# Altium project BNC_RJ45_adapter.PrjPcb
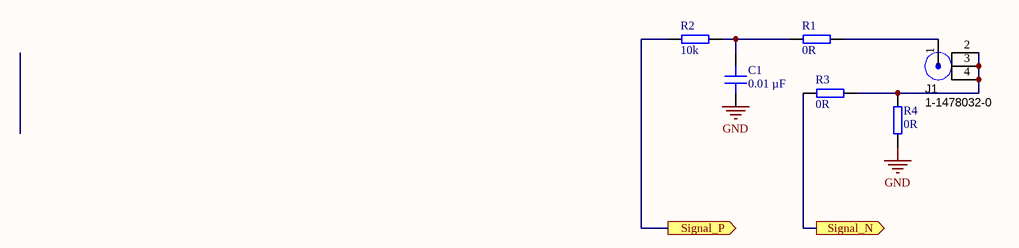
[diagram p0: schematic_rj45bnc.SchDoc]
ProjectRevision: 1.0
2 sheets, 12 parts. Net scope: hierarchical (ports join the sheet entries above them; power ports are global).
Board file: BNC_RJ45_8x.PcbDoc
Sheets:
  schematic_rj45bnc.SchDoc
  Top_sheet.SchDoc

## Sheet schematic_rj45bnc.SchDoc
size A4; Author: Florian Rosner; CompanyName: Technische Hochschule Nürnberg Georg Simon Ohm; Address1: Fürther Straße 250; Address2: 90429 Nürnberg; Address3: GERMANY; SheetNumber: 2; SheetTotal: 2; CompanyName2: Institut ELSYS

### Parts
(Parts that share a designator on the sheet are numbered #1, #2 ... from top to bottom, then left to right.)
C1  0.01 µF  [C_0805]
J1  1-1478032-0  [Right Angle BNC]
R1  0R  [RES 0805_2012]
R2  10k  [RES 1206_3216]
R3#1  0R  [RES 0805_2012]
R4#1  0R  [RES 0805_2012]

### Ports
Signal_N (out), Signal_P (out)

### Nets
GND: C1.1 R4#1.1  [project net AIN A N1]
NetC1_2: C1.2 R1.1 R2.2
NetJ1_1: J1.1 R1.2
NetJ1_2: J1.2 J1.3 J1.4 R3#1.2 R4#1.2
NetR2_1: R2.1 ; port Signal_P
NetR3#1_1: R3#1.1 ; port Signal_N

### Notes on the sheet
- Title
- Size:
- Date:
- A4
- Revision:
- Time:
- Sheet
- of
- Author:
- Project:

### Library data of the parts
C1 = C0805C103K3RACTU: Capacitor 0805, 25 VDC, 0.01 µF, X7R; Manufacturer: KEMET; Tolerance: 10 %; Voltage Rating: 25 VDC; Created from: MGremer; Manufacturer Part Number: C0805C103K3RACTU; PartID: 20; Created On: 20.12.2020 13:54:13; ComponentLink1Description: Datasheet; ComponentLink1URL: https://www.mouser.de/datasheet/2/212/KEM_C1002_X7R_SMD-1102033.pdf; Component Type: Capacitor 0805; Device Package: 0805; Last Updated: 17.11.2021 11:24:29; Mounting Type: SMD; Operating Temperature: -55 - 125°C; Series: SMD Comm X7R; Supplier 1: Mouser; Supplier Part Number 1: 80-C0805C103K3R; Type: Capacitor; Value: 0.01 µF; Live Cycle Status: 1; Stock number: Labor SMD Container
J1 = 1-1478032-0: BNC Connector; Manufacturer: TE; PartNumber: Used in BOM report; SymbolVersion: use current date i.e. 2008-05-20; SymbolCreator: Use LDAP id; CompType: Used in some BOM reports.  Useful for finding later.; U/M: EA, IN, or GM; Created from: FSchoenig, MGremer; MountType: SMT, TH, or N/A; RoHS: Used in BOM report.  Use Y or N.; PackageReference: eg:  0603, used in PnP report; ComponentLink1Description: Datasheet; ComponentLink1URL: https://www.te.com/commerce/DocumentDelivery/DDEController?Action=showdoc&DocId=Data+Sheet%7F6-1773448-5_ZDC_RF_COAX_50-75_OHM%7F1007%7Fpdf%7FEnglish%7FENG_DS_6-1773448-5_ZDC_RF_COAX_50-75_OHM_1007.pdf&src-supplier=Avnet; Alternate PartNumber: -; Alternate Manufacturer: -; Supplier 1: Digi-Key; Supplier Part Number 1: A97560-ND; Manufacturer Part Number: 1-1478032-0; PartID: 3; Created On: 12.05.2021 17:41:04; Component Type: BNC; Device Package: BNC; Last Updated: 24.08.2021 10:46:04; Mounting Type: THT; Type: BNC; Live Cycle Status: 1; Stock number: not stored
R1 R3#1 R4#1 = RC0805JR-100RL: SMD resistor 5%; Manufacturer: Yageo; Created from: MGremer; Manufacturer Part Number: RC0805JR-100RL; PartID: 186; Created On: 14.12.2020 16:17:14; ComponentLink1Description: Datasheet; ComponentLink1URL: https://www.mouser.com/catalog/specsheets/Yageo-03-18-2021-PYu-RC_Group_51_RoHS_L_11.pdf; Component Type: SMD resistor; Device Package: 0805; Last Updated: 14.12.2020 18:22:52; Mounting Type: SMD; Supplier 1: Mouser; Supplier Part Number 1: 603-RC0805JR-100RL; Type: Resistor; Tolerance: 5%; Value: 0R; Live Cycle Status: 1; Stock number: not stored
R2 = ERJ-8ENF1002V: SMD resistor 1%; Manufacturer: Panasonic; Created from: MGremer; Manufacturer Part Number: ERJ-8ENF1002V; PartID: 201; Created On: 14.12.2020 16:17:14; ComponentLink1Description: Datasheet; ComponentLink1URL: https://www.mouser.de/datasheet/2/315/AOA0000C304-1149620.pdf; Component Type: SMD resistor; Device Package: 1206; Last Updated: 24.01.2021 12:18:37; Mounting Type: SMD; Supplier 1: Mouser; Supplier Part Number 1: 667-ERJ-8ENF1002V; Type: Resistor; Tolerance: 1 %; Value: 10k; Live Cycle Status: 1; Stock number: not stored

## Sheet Top_sheet.SchDoc
size A4; CompanyName: Technische Hochschule Nürnberg Georg Simon Ohm; Organization: UltraZohm; Address1: Kesslerplatz 12; Address2: 90489 Nürnberg; Address3: GERMANY; SheetNumber: 1; SheetTotal: 2; Website: www.ultrazohm.com
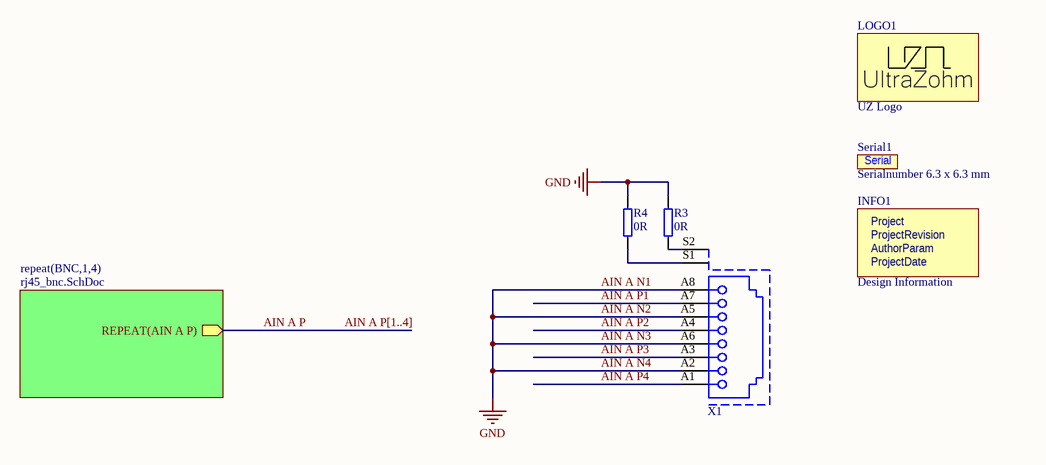
[diagram p1: Top_sheet.SchDoc]

### Parts
(Parts that share a designator on the sheet are numbered #1, #2 ... from top to bottom, then left to right.)
INFO1  Design Information  [Design_info]  (no BOM)
LOGO1  UZ Logo  [UZ_Logo_small]  (no BOM)
R3#2  0R  [R_0603_TE]
R4#2  0R  [R_0603_TE]
Serial1  Serialnumber 6.3 x 6.3 mm  [SERIAL_6.3X6.3MM]  (no BOM)
X1  (no value)  [R-RJ45R10P-B000]

### Sub-sheets
repeat(BNC,1,4) = rj45_bnc.SchDoc (file not in this document): REPEAT(AIN A P) (out)

### Nets
AIN A N1: R3#2.1 R4#2.1 X1.A2 X1.A5 X1.A6 X1.A8  [also labelled AIN A N2, AIN A N3, AIN A N4, GND]
AIN A P: sheet repeat(BNC,1,4)/REPEAT(AIN A P)
AIN A P1: X1.A7
AIN A P2: X1.A4
AIN A P3: X1.A3
AIN A P4: X1.A1
NetR3#2_2: R3#2.2 X1.S2
NetR4#2_2: R4#2.2 X1.S1

### Buses and harness runs
bus AIN A P[1..4]

### Notes on the sheet
- Title
- Revision:
- Design Engineer:
- Date:
- Project:
- Sheet
- of
- (in symbol Design Information) Project; ProjectRevision; AuthorParam; ProjectDate
- (in symbol Serial Number) Serial

### Library data of the parts
INFO1 = Design Information: Manufacturer: UltraZohm; Created from: MGremer; Manufacturer Part Number: Design Information; PartID: 12; Created On: 03.11.2021 09:04:23; ComponentLink1Description: https://docs.ultrazohm.com/; ComponentLink1URL: homepage; Component Type: Design Information; Last Updated: 03.11.2021 09:28:34; Supplier 1: -; Supplier Part Number 1: -; Type: Design Information; Value: Design Information; Live Cycle Status: 1
LOGO1 = Logo small: Manufacturer: UltraZohm; Created from: MGremer; Created: Jan2021_Liegmann; Value: Logo; Manufacturer Part Number: Logo small; PartID: 10; Created On: 03.11.2021 09:04:23; ComponentLink1Description: https://docs.ultrazohm.com/; ComponentLink1URL: homepage; Component Type: Logo; Last Updated: 03.11.2021 09:05:50; Supplier 1: -; Supplier Part Number 1: -; Type: Logo; Live Cycle Status: 1
R3#2 R4#2 = UZgen_R_0603_0R: Generic resistor; Manufacturer: UZgen; Tolerance: 1 %; Created from: UZgenTool; Manufacturer Part Number: UZgen_R_0603_0R; PartID: 581; Created On: 08.07.2024 14:34:30; Value: 0R; Device Package: 0603; Mounting Type: SMD; Last Updated: 08.07.2024 14:34:30; LCSC Part Number: C21189
Serial1 = Serial Number: Manufacturer: UltraZohm; Value: REV; Created from: MGremer; Created: 2018_09_18_AGeiger; Manufacturer Part Number: Serial Number; PartID: 11; Created On: 03.11.2021 09:04:23; ComponentLink1Description: https://docs.ultrazohm.com/; ComponentLink1URL: homepage; Component Type: Serial Number; Last Updated: 03.11.2021 09:28:34; Supplier 1: -; Supplier Part Number 1: -; Type: Serial Number; Live Cycle Status: 1
X1 = R-RJ45R10P-B000: RJ45Receptacle 1 Shielded Bend insert Without LED 0℃~+70℃ Plugin Ethernet Connectors / Modular Connectors (RJ45 RJ11) ROHS; Manufacturer: Ckmtw(Shenzhen Cankemeng); Created from: KIlhan; Manufacturer Part Number: R-RJ45R10P-B000; PartID: 57; Created On: 20.03.2025 09:19:07; ComponentLink1Description: Datasheet; ComponentLink1URL: https://jlcpcb.com/api/file/downloadByFileSystemAccessId/8588892085580021760; Last Updated: 18.05.2025 18:44:47; Mounting Type: THT; Operating Temperature: 0 °C to +70 °C; Series: RJ45; Supplier 1: LCSC; Supplier Part Number 1: C386758; Value: R-RJ45R10P-B000; LCSC Part Number: C386758

## Nets that join several sheets
AIN A N1: schematic_rj45bnc (C1.1 R4#1.1), Top_sheet (6 pins)

## Assembly variants
Manufacturing: not fitted C1_RJ1 C1_RJ2